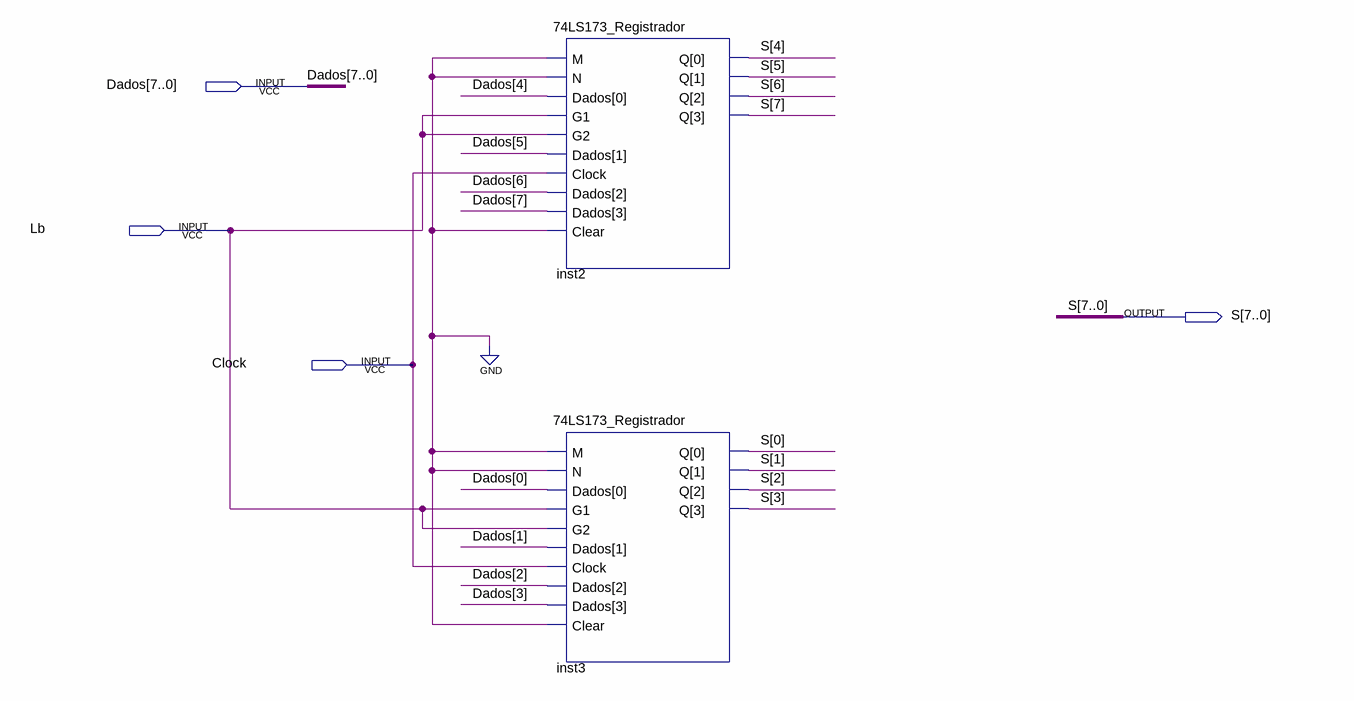
[diagram p0: schematic sheet]
// Quartus schematic Registrador_B.bdf as structural Verilog: 2 symbols, 4 pins
module Registrador_B (
  input  [7:0] Dados,
  input  Lb,
  input  Clock,
  output [7:0] S
);

  \74LS173_Registrador  inst2 (
    .M(1'b0), .N(1'b0), .Dados(Dados[7:4]), .G1(Lb), .G2(Lb), .Clock(Clock), .Clear(1'b0), .Q(S[7:4]));
  \74LS173_Registrador  inst3 (
    .M(1'b0), .N(1'b0), .Dados(Dados[3:0]), .G1(Lb), .G2(Lb), .Clock(Clock), .Clear(1'b0), .Q(S[3:0]));
endmodule
